# EAGLE design stepper step up (EAGLE 8.4.1)
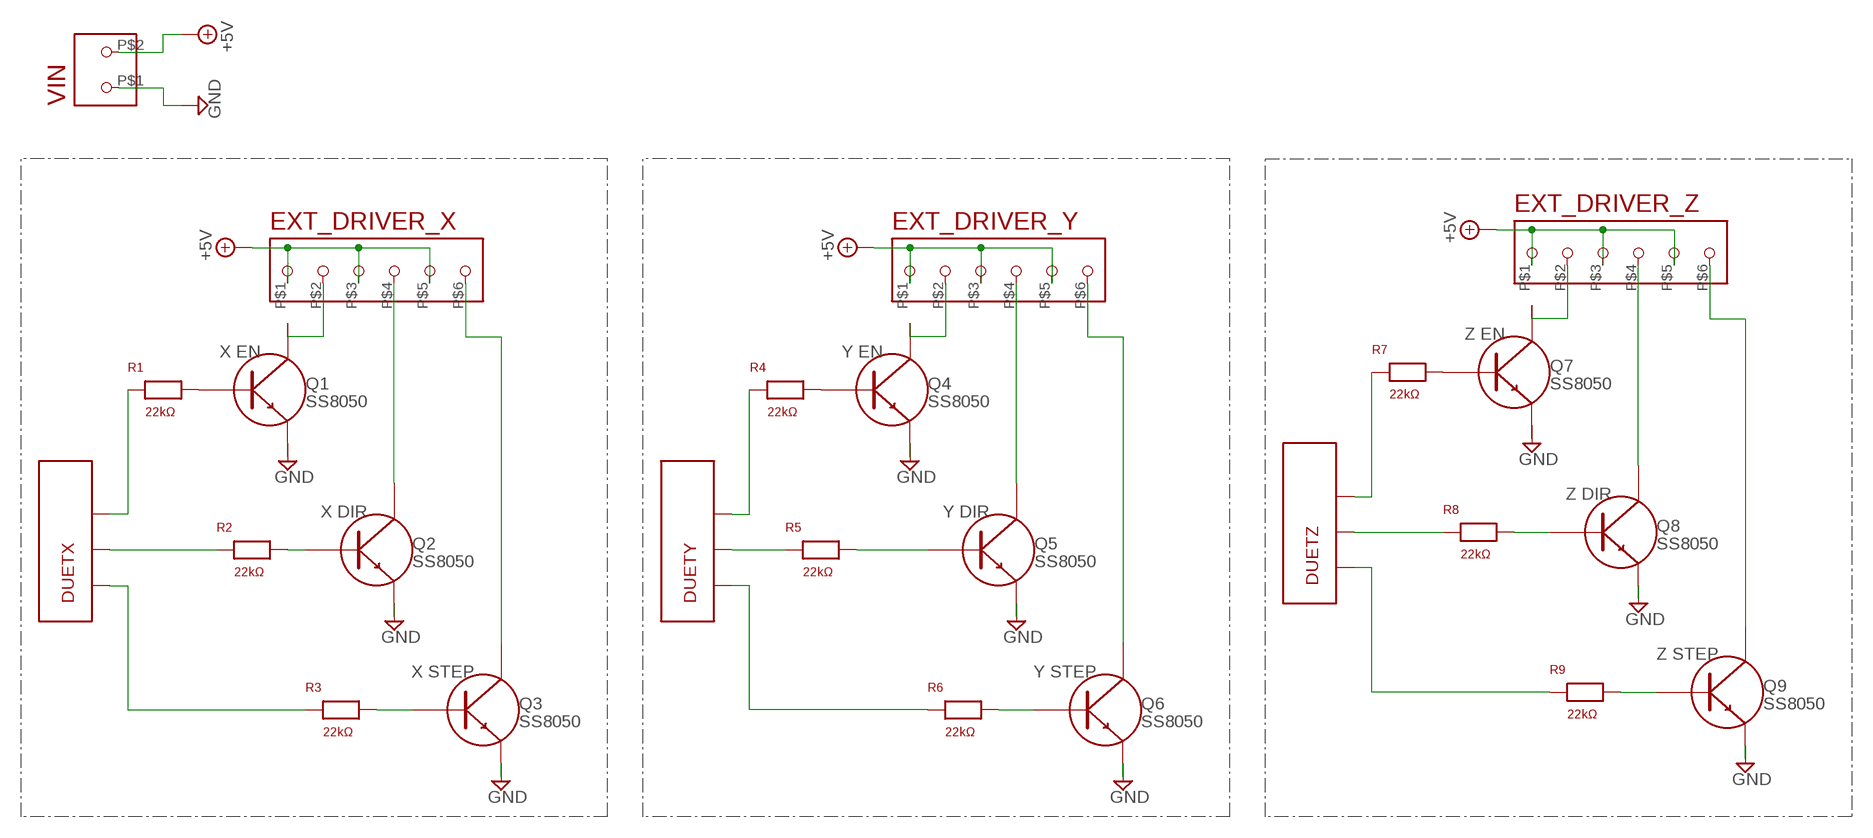
[diagram p0: schematic, sheet 1]

## Parts
DUETX  BKL_3XPINHEAD  [BKL_3XPINHEAD]
DUETY  BKL_3XPINHEAD  [BKL_3XPINHEAD]
DUETZ  BKL_3XPINHEAD  [BKL_3XPINHEAD]
EXT_DRIVER_X  SCREW_X6  [SCREW_X6]
EXT_DRIVER_Y  SCREW_X6  [SCREW_X6]
EXT_DRIVER_Z  SCREW_X6  [SCREW_X6]
Q1  SS8050  NPN_SS8050  [NPN_SS8050]
Q2  SS8050  NPN_SS8050  [NPN_SS8050]
Q3  SS8050  NPN_SS8050  [NPN_SS8050]
Q4  SS8050  NPN_SS8050  [NPN_SS8050]
Q5  SS8050  NPN_SS8050  [NPN_SS8050]
Q6  SS8050  NPN_SS8050  [NPN_SS8050]
Q7  SS8050  NPN_SS8050  [NPN_SS8050]
Q8  SS8050  NPN_SS8050  [NPN_SS8050]
Q9  SS8050  NPN_SS8050  [NPN_SS8050]
R1  22kΩ  VERT_RES  [VERT_RES]
R2  22kΩ  VERT_RES  [VERT_RES]
R3  22kΩ  VERT_RES  [VERT_RES]
R4  22kΩ  VERT_RES  [VERT_RES]
R5  22kΩ  VERT_RES  [VERT_RES]
R6  22kΩ  VERT_RES  [VERT_RES]
R7  22kΩ  VERT_RES  [VERT_RES]
R8  22kΩ  VERT_RES  [VERT_RES]
R9  22kΩ  VERT_RES  [VERT_RES]
VIN  SCREW_X2  [SCREW_X2]

## Nets
+5V: EXT_DRIVER_X.P$1 EXT_DRIVER_X.P$3 EXT_DRIVER_X.P$5 EXT_DRIVER_Y.P$1 EXT_DRIVER_Y.P$3 EXT_DRIVER_Y.P$5 EXT_DRIVER_Z.P$1 EXT_DRIVER_Z.P$3 EXT_DRIVER_Z.P$5 VIN.P$2
GND: Q1.E Q2.E Q3.E Q4.E Q5.E Q6.E Q7.E Q8.E Q9.E VIN.P$1
N$1: Q9.B R9.P$2
N$2: DUETZ.P$1 R9.P$1
N$3: DUETZ.P$2 R8.P$1
N$4: Q8.B R8.P$2
N$5: DUETZ.P$3 R7.P$1
N$6: Q7.B R7.P$2
N$7: Q6.B R6.P$2
N$8: DUETY.P$1 R6.P$1
N$9: DUETY.P$2 R5.P$1
N$10: Q5.B R5.P$2
N$11: DUETY.P$3 R4.P$1
N$12: Q4.B R4.P$2
N$13: Q1.B R1.P$2
N$14: DUETX.P$3 R1.P$1
N$15: DUETX.P$2 R2.P$1
N$16: Q2.B R2.P$2
N$17: DUETX.P$1 R3.P$1
N$18: Q3.B R3.P$2
X_DIR-: EXT_DRIVER_X.P$4 Q2.C
X_EN-: EXT_DRIVER_X.P$2 Q1.C
X_STEP-: EXT_DRIVER_X.P$6 Q3.C
Y_DIR-: EXT_DRIVER_Y.P$4 Q5.C
Y_EN-: EXT_DRIVER_Y.P$2 Q4.C
Y_STEP-: EXT_DRIVER_Y.P$6 Q6.C
Z_DIR-: EXT_DRIVER_Z.P$4 Q8.C
Z_EN-: EXT_DRIVER_Z.P$2 Q7.C
Z_STEP-: EXT_DRIVER_Z.P$6 Q9.C

## Notes on the sheet
- Z EN
- X EN | Y EN
- Z DIR
- X DIR | Y DIR
- Z STEP
- X STEP | Y STEP

## Library data of the parts
DUETX DUETY DUETZ = mesoprint:BKL_3XPINHEAD
EXT_DRIVER_X EXT_DRIVER_Y EXT_DRIVER_Z = mesoprint:SCREW_X6
Q1-Q9 = mesoprint:NPN_SS8050
R1-R9 = mesoprint:VERT_RES
VIN = mesoprint:SCREW_X2

## Board
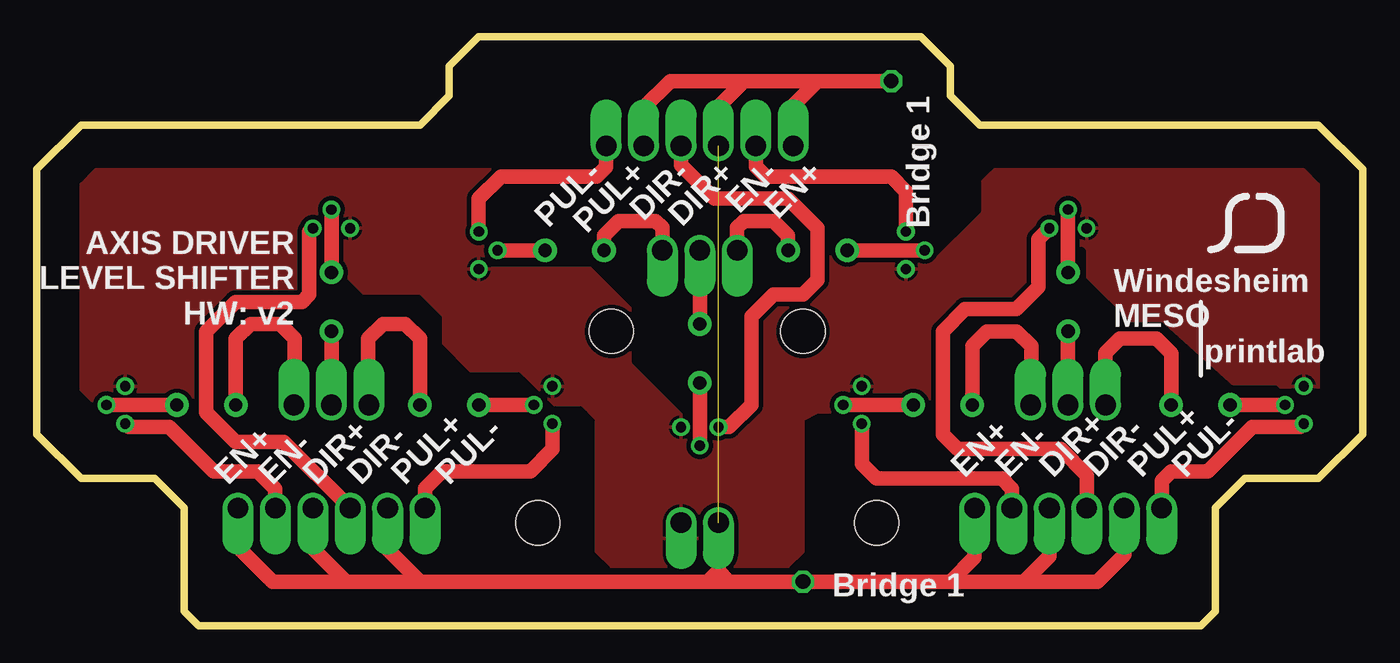
[diagram p1: board, top side]
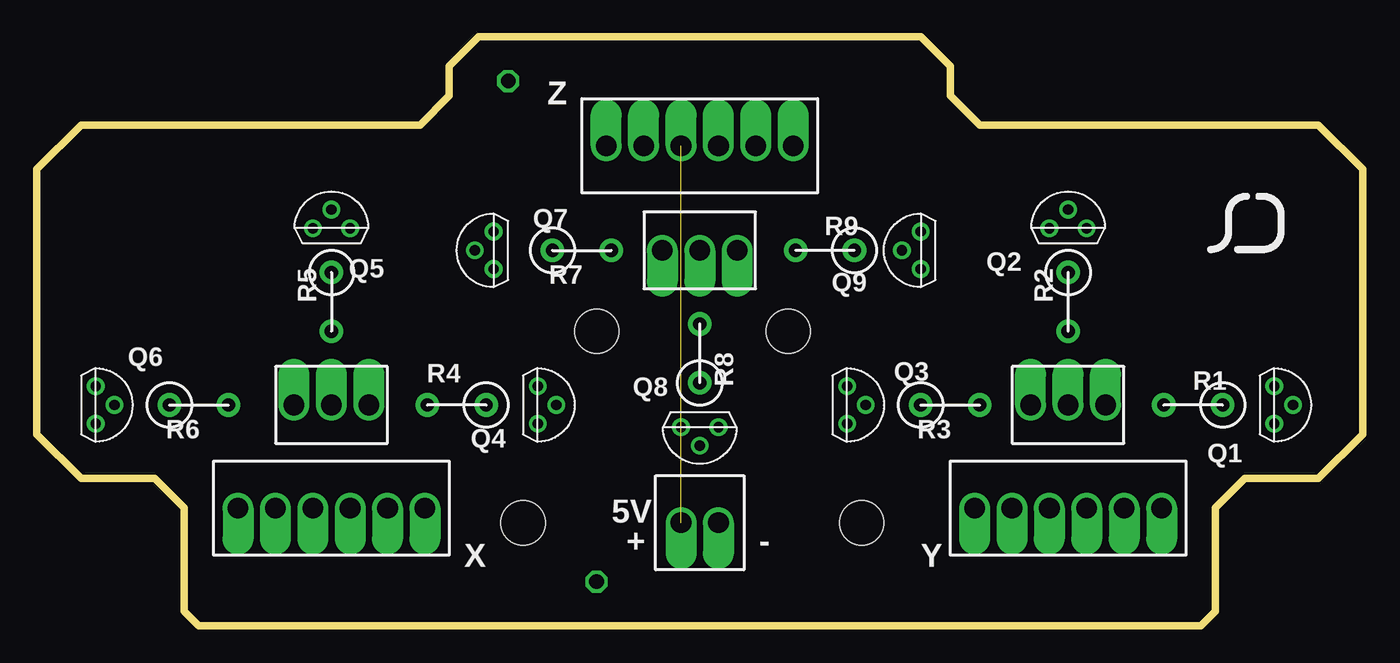
[diagram p2: board, bottom side, seen from below]

Size 90 x 40 mm. Coordinates in mm from the lower left corner, seen from the top.
Outline: 11,0 10,1 10,8 8,10 3,10 0,13 0,31 3,34 26,34 28,36 28,38 30,40 60,40 62,38 62,36 64,34 87,34 90,31 90,13 87,10 82,10 80,8 80,1 79,0 11,0
Copper layers (1*16): Top 0.018mm / dielectric 1.55mm / Bottom 0.018mm
Design rules "eC_2Layer_PClass6_BaseCopperO18_eCDefault": minimum track width 0.15mm, minimum drill 0.35mm, track to track 0.15mm, track to pad 0.15mm, pad to pad 0.15mm, via to via 0.15mm, smd to smd 0mil, copper to edge 0.25mm, drill to drill 0.35mm, minimum pad ring 0.175mm, minimum via ring 0.125mm, stop-mask expansion 0mil, vias tented up to drill 0.45mm, thermal gap 0.2mm
Holes 3 mm at 34,7 57,7 52,20 39,20
tRestrict: 25 lines

### Footprints (pad centres in the part's own frame; a part is rotated, then mirrored left to right if it is on the bottom)
BKL_3XPINHEAD = drill 1.4 offset: P$1 -2.54,0; P$2 0,0; P$3 2.54,0
SCREW_X6 = drill 1.4 offset: P$1 -6.35,0; P$2 -3.81,0; P$3 -1.27,0; P$4 1.27,0; P$5 3.81,0; P$6 6.35,0
NPN_SS8050 = drill 0.7 pad 1.2: B 0,1.27; C 1.27,0; E -1.27,0
VERT_RES = drill 0.9 pad 1.6: P$1 -2,0; P$2 2,0
SCREW_X2 = drill 1.4 offset: P$1 -1.27,0; P$2 1.27,0

### Placement (x,y rotation side)
DUETX  20,15 180 top
DUETY  70,15 180 top
DUETZ  45,25.5 0 top
EXT_DRIVER_X  20,8 0 top
EXT_DRIVER_Y  70,8 0 top
EXT_DRIVER_Z  45,32.6 180 top
Q1  6,15 270 bottom
Q2  20,27 0 bottom
Q3  35,15 270 bottom
Q4  56,15 270 bottom
Q5  70,27 0 bottom
Q6  86,15 270 bottom
Q7  59,25.5 90 bottom
Q8  45,13.5 180 bottom
Q9  30,25.5 90 bottom
R1  11.5,15 0 bottom
R2  20,22 90 bottom
R3  28,15 180 bottom
R4  61.5,15 0 bottom
R5  70,22 90 bottom
R6  79,15 180 bottom
R7  53,25.5 180 bottom
R8  45,18.5 270 bottom
R9  36.5,25.5 0 bottom
VIN  45,7 0 top

### Tracks (layer width: path | path; a pad name or v marks a point on that pad's centre or on a via)
+5V  (via drill 1)  (1 unrouted)
  Top 1: EXT_DRIVER_Z.P$5 41.19,35.19 43,37 48,37 | v58,37 53,37 | 53,37 48,37 | 48,37 46.27,35.27 EXT_DRIVER_Z.P$3 | 53,37 51.35,35.35 EXT_DRIVER_Z.P$1 | 45.54,3 26,3 | 45.54,3 47,3 | 47,3 v52,3 62,3 | EXT_DRIVER_X.P$5 23.81,5.19 26,3 | 26,3 21,3 | 21,3 18.73,5.27 EXT_DRIVER_X.P$3 | 21,3 16,3 13.65,5.35 EXT_DRIVER_X.P$1 | EXT_DRIVER_Y.P$1 63.65,4.65 62,3 | 62,3 67,3 | 67,3 68.73,4.73 EXT_DRIVER_Y.P$3 | 67,3 72,3 73.81,4.81 EXT_DRIVER_Y.P$5 | 47,3 46.27,3.73 | 46.27,3.73 VIN.P$2 | 46.27,3.73 45.54,3
GND
  pour Top (isolate 0.3): 51,4 39,4 38,5 38,14 37,15 4,15 3,16 3,30 4,31 86,31 87,30 87,16 86,14.5 53,14.5 52,14 52,5
N$1
  Top 1: Q9.B R9.P$2
N$2
  Top 1: DUETZ.P$1 42.46,27.04 42,27.5 39.5,27.5 38.5,26.5 R9.P$1
N$3
  Top 1: R8.P$1 DUETZ.P$2
N$4
  Top 1: Q8.B R8.P$2
N$5
  Top 1: DUETZ.P$3 47.54,27.04 48,27.5 50,27.5 51,26.5 R7.P$1
N$6
  Top 1: R7.P$2 Q7.B
N$7
  Top 1: R6.P$2 Q6.B
N$8
  Top 1: DUETY.P$1 72.54,18.54 73.5,19.5 76,19.5 77,18.5 R6.P$1
N$9
  Top 1: DUETY.P$2 R5.P$1
N$10
  Top 1: R5.P$2 Q5.B
N$11
  Top 1: R4.P$1 63.5,19 64.5,20 66.5,20 67.5,19 67.5,15.04 DUETY.P$3
N$12
  Top 1: Q4.B R4.P$2
N$13
  Top 1: R1.P$2 Q1.B
N$14
  Top 1: DUETX.P$3 17.5,15.04 17.5,19.5 16.5,20.5 14.5,20.5 13.5,19.5 R1.P$1
N$15
  Top 1: DUETX.P$2 R2.P$1
N$16
  Top 1: R2.P$2 Q2.B
N$17
  Top 1: DUETX.P$1 22.5,15.04 22.5,19.5 23.5,20.5 25,20.5 26,19.5 R3.P$1
N$18
  Top 1: R3.P$2 Q3.B
X_DIR-
  Top 1: EXT_DRIVER_X.P$4 16.77,12.5 13.5,12.5 11.5,14.5 11.5,20 13.5,22 18,22 18.5,22.5 18.5,26.77 Q2.C
X_EN-
  Top 1: EXT_DRIVER_X.P$2 16.19,9.31 15,10.5 12,10.5 9,13.5 6.23,13.5 Q1.C
X_STEP-
  Top 1: EXT_DRIVER_X.P$6 26.35,9.35 27.5,10.5 33.5,10.5 35,12 Q3.C
Y_DIR-
  Top 1: EXT_DRIVER_Y.P$4 71.27,10.23 69.5,12 62.5,12 61.5,13 61.5,20 63,21.5 66.5,21.5 68,23 68,26.27 Q5.C
Y_EN-
  Top 1: EXT_DRIVER_Y.P$2 66.19,9.31 65.5,10 57,10 56,11 Q4.C
Y_STEP-
  Top 1: EXT_DRIVER_Y.P$6 76.35,9.85 77,10.5 79.5,10.5 82.5,13.5 85.77,13.5 Q6.C
Z_DIR-
  Top 0.4: 43.8,34.03 EXT_DRIVER_Z.P$4
  Top 1: EXT_DRIVER_Z.P$4 43.73,31.27 46,29 51,29 53,27 53,23.5 52,22.5 50,22.5 48.5,21 48.5,15 47,13.5 Q8.C
Z_EN-
  Top 1: EXT_DRIVER_Z.P$2 48.81,31.19 49.5,30.5 58,30.5 59,29.5 Q7.C
Z_STEP-
  Top 1: EXT_DRIVER_Z.P$6 38.65,31.15 38,30.5 31.5,30.5 30,29 Q9.C

### Text on the board
tPlace: Bridge 1 | PUL- | PUL+ | DIR- | DIR+ | EN- | EN+ | AXIS DRIVER / LEVEL SHIFTER / HW: v2 | Windesheim / MESO / printlab | EN+ | EN- | DIR+ | DIR- | PUL+ | PUL- | EN+ | EN- | DIR+ | DIR- | PUL+ | PUL- | Bridge 1
bPlace: Z | 5V | - | + | Y | X